# Altium schematic sheet Sheet1.SchDoc
size A4; SheetNumber: 1; SheetTotal: 1
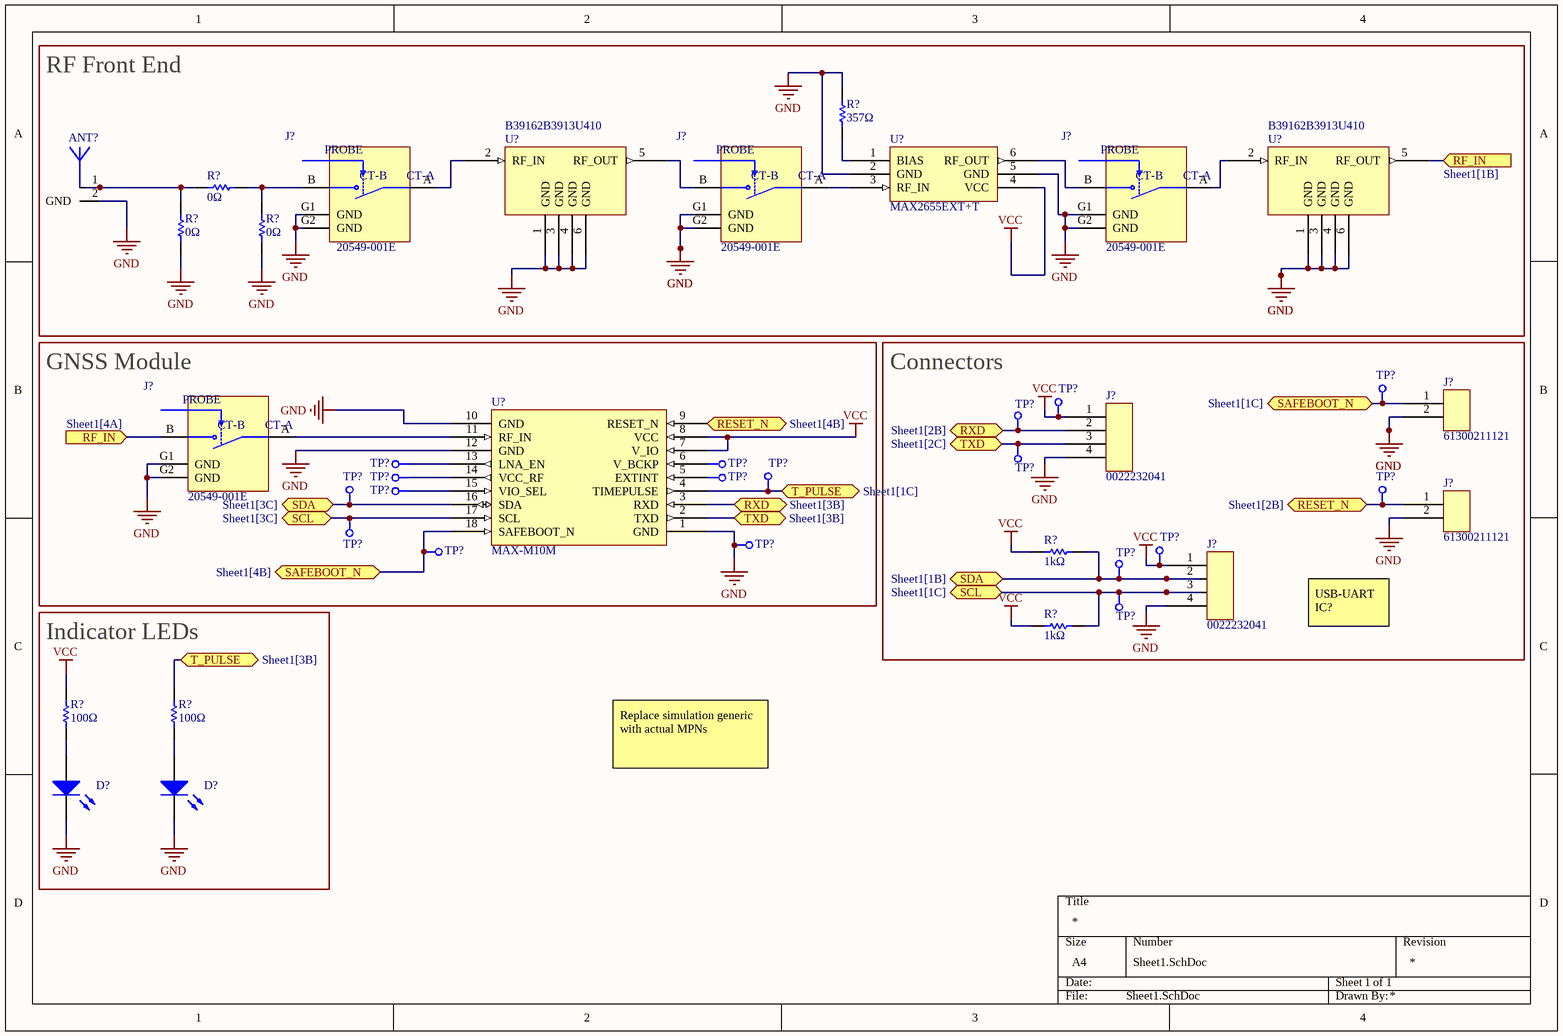
[diagram p0: Sheet1.SchDoc]

## Parts
(Parts that share a designator on the sheet are numbered #1, #2 ... from top to bottom, then left to right.)
ANT?  ANT-GNSSCP-TH18L1  [ANT-GNSSCP-TH18L1]  (value not drawn)
D?#1  Light-Emitting Diode  (value not drawn)
D?#2  Light-Emitting Diode  (value not drawn)
J?#1  20549-001E  [IPEX_20549-001E]
J?#2  20549-001E  [IPEX_20549-001E]
J?#3  20549-001E  [IPEX_20549-001E]
J?#4  61300211121
J?#5  0022232041
J?#6  20549-001E  [IPEX_20549-001E]
J?#7  61300211121
J?#8  0022232041
R?#1  value 357Ω  (hidden comment: Resistor)
R?#2  value 0Ω  (hidden comment: Resistor)
R?#3  value 0Ω  (hidden comment: Resistor)
R?#4  value 0Ω  (hidden comment: Resistor)
R?#5  value 1kΩ  (hidden comment: Resistor)
R?#6  value 1kΩ  (hidden comment: Resistor)
R?#7  value 100Ω  (hidden comment: Resistor)
R?#8  value 100Ω  (hidden comment: Resistor)
TP?#1  TEST_POINT  (value not drawn)
TP?#2  TEST_POINT  (value not drawn)
TP?#3  TEST_POINT  (value not drawn)
TP?#4  TEST_POINT  (value not drawn)
TP?#5  TEST_POINT  (value not drawn)
TP?#6  TEST_POINT  (value not drawn)
TP?#7  TEST_POINT  (value not drawn)
TP?#8  TEST_POINT  (value not drawn)
TP?#9  TEST_POINT  (value not drawn)
TP?#10  TEST_POINT  (value not drawn)
TP?#11  TEST_POINT  (value not drawn)
TP?#12  TEST_POINT  (value not drawn)
TP?#13  TEST_POINT  (value not drawn)
TP?#14  TEST_POINT  (value not drawn)
TP?#15  TEST_POINT  (value not drawn)
TP?#16  TEST_POINT  (value not drawn)
TP?#17  TEST_POINT  (value not drawn)
TP?#18  TEST_POINT  (value not drawn)
U?#1  B39162B3913U410  [B39162B3913U410]
U?#2  MAX2655EXT+T  [MAX2655EXT+T]
U?#3  B39162B3913U410  [B39162B3913U410]
U?#4  MAX-M10M  [MAX-M10M]

## Blocks framed on the sheet
RF Front End: ANT? J?#1-J?#3 R?#1-R?#4 U?#1-U?#3
GNSS Module: J?#6 TP?#5-TP?#11 TP?#13-TP?#15 U?#4
Connectors: J?#4 J?#5 J?#7 J?#8 R?#5 R?#6 TP?#1-TP?#4 TP?#12 TP?#16-TP?#18
Indicator LEDs: D?#1 D?#2 R?#7 R?#8

## Ports
RESET_N (bidir, see Sheet1[2B]), RESET_N (bidir, see Sheet1[4B]), RF_IN (in, see Sheet1[1B]), RF_IN (in, see Sheet1[4A]), RXD (bidir, see Sheet1[2B]), RXD (bidir, see Sheet1[3B]), SAFEBOOT_N (bidir, see Sheet1[1C]), SAFEBOOT_N (bidir, see Sheet1[4B]), SCL (bidir, see Sheet1[1C]), SCL (bidir, see Sheet1[3C]), SDA (bidir, see Sheet1[1B]), SDA (bidir, see Sheet1[3C]), T_PULSE (bidir, see Sheet1[1C]), T_PULSE (bidir, see Sheet1[3B]), TXD (bidir, see Sheet1[2C]), TXD (bidir, see Sheet1[3B])

## Nets
GND: ANT?.2(GND) D?#1.2(K) D?#2.2(K) J?#1.G1(GND) J?#1.G2(GND) J?#2.G1(GND) J?#2.G2(GND) J?#3.G1(GND) J?#3.G2(GND) J?#4.2 J?#5.4 J?#6.G1(GND) J?#6.G2(GND) J?#7.2 J?#8.4 R?#1.2 R?#3.1 R?#4.1 TP?#14.1 U?#1.1(GND) U?#1.3(GND) U?#1.4(GND) U?#1.6(GND) U?#2.2(GND) U?#2.5(GND) U?#3.1(GND) U?#3.3(GND) U?#3.4(GND) U?#3.6(GND) U?#4.1(GND) U?#4.10(GND) U?#4.12(GND)
VCC: J?#5.1 J?#8.1 R?#5.2 R?#6.2 R?#7.2 TP?#2.1 TP?#16.1 U?#2.4(VCC) U?#4.7(V_IO) U?#4.8(VCC)
RESET_N: J?#7.1 TP?#12.1 U?#4.9(RESET_N) ; port RESET_N
RF_IN: J?#6.B(CT-B) U?#3.5(RF_OUT) ; port RF_IN
RXD: J?#5.2 TP?#3.1 U?#4.3(RXD) ; port RXD
SAFEBOOT_N: J?#4.1 TP?#1.1 TP?#15.1 U?#4.18(SAFEBOOT_N) ; port SAFEBOOT_N
SCL: J?#8.3 R?#6.1 TP?#13.1 TP?#18.1 U?#4.17(SCL) ; port SCL
SDA: J?#8.2 R?#5.1 TP?#11.1 TP?#17.1 U?#4.16(SDA) ; port SDA
T_PULSE: R?#8.2 TP?#10.1 U?#4.4(TIMEPULSE) ; port T_PULSE
TXD: J?#5.3 TP?#4.1 U?#4.2(TXD) ; port TXD
NetANT?_1: ANT?.1(RF_IN) R?#2.1 R?#3.2
NetD?#1_1: D?#1.1(A) R?#7.1
NetD?#2_1: D?#2.1(A) R?#8.1
NetJ?#1_A: J?#1.A(CT-A) U?#1.2(RF_IN)
NetJ?#1_B: J?#1.B(CT-B) R?#2.2 R?#4.2
NetJ?#2_A: J?#2.A(CT-A) U?#2.3(RF_IN)
NetJ?#2_B: J?#2.B(CT-B) U?#1.5(RF_OUT)
NetJ?#3_A: J?#3.A(CT-A) U?#3.2(RF_IN)
NetJ?#3_B: J?#3.B(CT-B) U?#2.6(RF_OUT)
NetJ?#6_A: J?#6.A(CT-A) U?#4.11(RF_IN)
NetR?#1_1: R?#1.1 U?#2.1(BIAS)
NetTP?#5_1: TP?#5.1 U?#4.13(LNA_EN)
NetTP?#6_1: TP?#6.1 U?#4.6(V_BCKP)
NetTP?#7_1: TP?#7.1 U?#4.14(VCC_RF)
NetTP?#8_1: TP?#8.1 U?#4.5(EXTINT)
NetTP?#9_1: TP?#9.1 U?#4.15(VIO_SEL)

## Notes on the sheet
- USB-UART IC?
- Replace simulation generic with actual MPNs
- (in symbol 20549-001E) PROBE

## Library data of the parts
ANT? = ANT-GNSSCP-TH18L1: CERAMIC PATCH GNSS ANTENNA
D?#1 D?#2 = LED: AF: 1; BV: 0; BV_MAX: 1e99; EG: 1.11; FC: 0.5; IBV: 0.001; IS: 1e-14; MJSW: 0.33; NTUN: 30; TNOM: 27; XTI: 3; SimulationGenericComponent: True; CJO: 0; CJP: 0; CTA: 0; CTP: 0; FCS: 0.5; FV_MAX: 1e99; IKF: 0; IKR: 0; ISR: 1e-14; JSW: 0; JTUN: 0; JTUNSW: 0; KEG: 1; KF: 0; LEVEL: 1; N: 1; NBV: 1; NR: 1; NS: 1; PHP: 1; RS: 0; TCV: 0; TLEV: 0; TLEVC: 0; TM1: 0; TM2: 0; TPB: 0; TPHP: 0; TRS: 0; TRS2: 0; TT: 0; TTT1: 0; TTT2: 0; VJ: 1; XTITUN: 3
J?#1-J?#3 J?#6 = 20549-001E: 1 POS Vertical SMD Coaxial RF switch connector with a 2.3 x 2.3 mm footprint and support to 11 GHz, MHC; MF: I-PEX; Package: None; Value: *; MP: 20549-001E; Availability: Warning; Price: None; SnapEDA_Link: https://www.snapeda.com/parts/20549-001E/I-PEX/view-part/3220455/?ref=snap; Check_prices: https://www.snapeda.com/parts/20549-001E/I-PEX/view-part/3220455/?ref=eda
J?#4 J?#7 = 61300211121: CONN HEADER VERT 2POS 2.54MM
J?#5 J?#8 = 0022232041: CONN HEADER VERT 4POS 2.54MM
R?#1-R?#8 = Resistor: TC1: 0; SimulationGenericComponent: True; TC2: 0
TP?#1 TP?#2 TP?#5-TP?#16 = TEST_POINT: TEST POINT 2MM
U?#1 U?#3 = B39162B3913U410: FILTER SAW 1.588GHZ 6SMD
U?#2 = MAX2655EXT+T: IC AMP GPS 1.4GHZ-1.7GHZ SC70-6
U?#4 = MAX-M10M: GNSS LCC RX MOD, ROM, CRYSTAL